# Altium schematic sheet 0099_STORAGE - M.SchDoc
size 848 x 558 mm
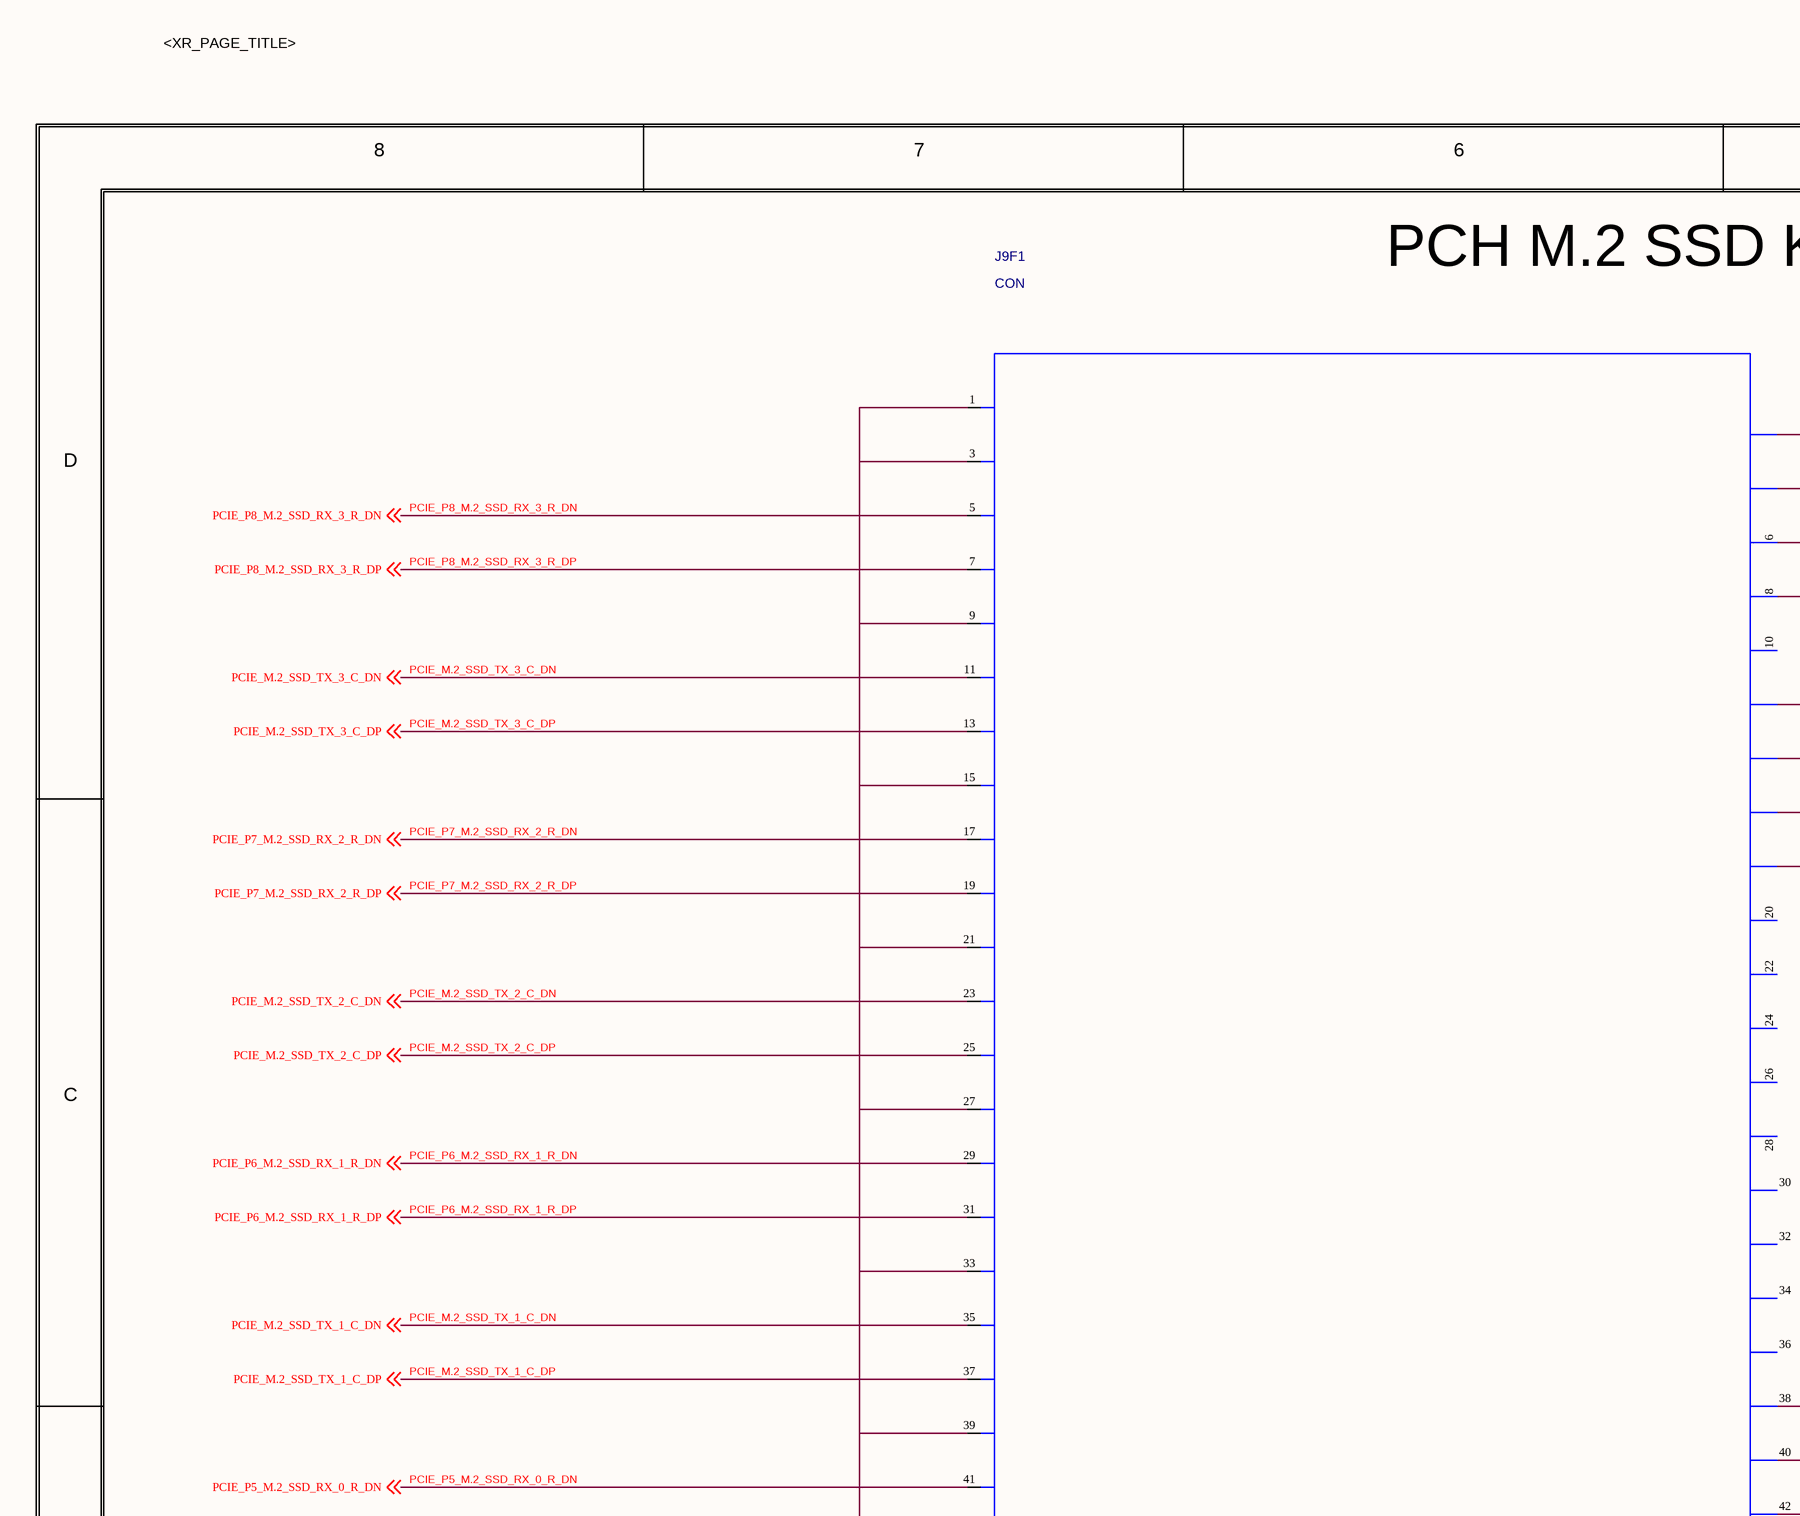
[diagram p0: 0099_STORAGE - M.SchDoc, top left]
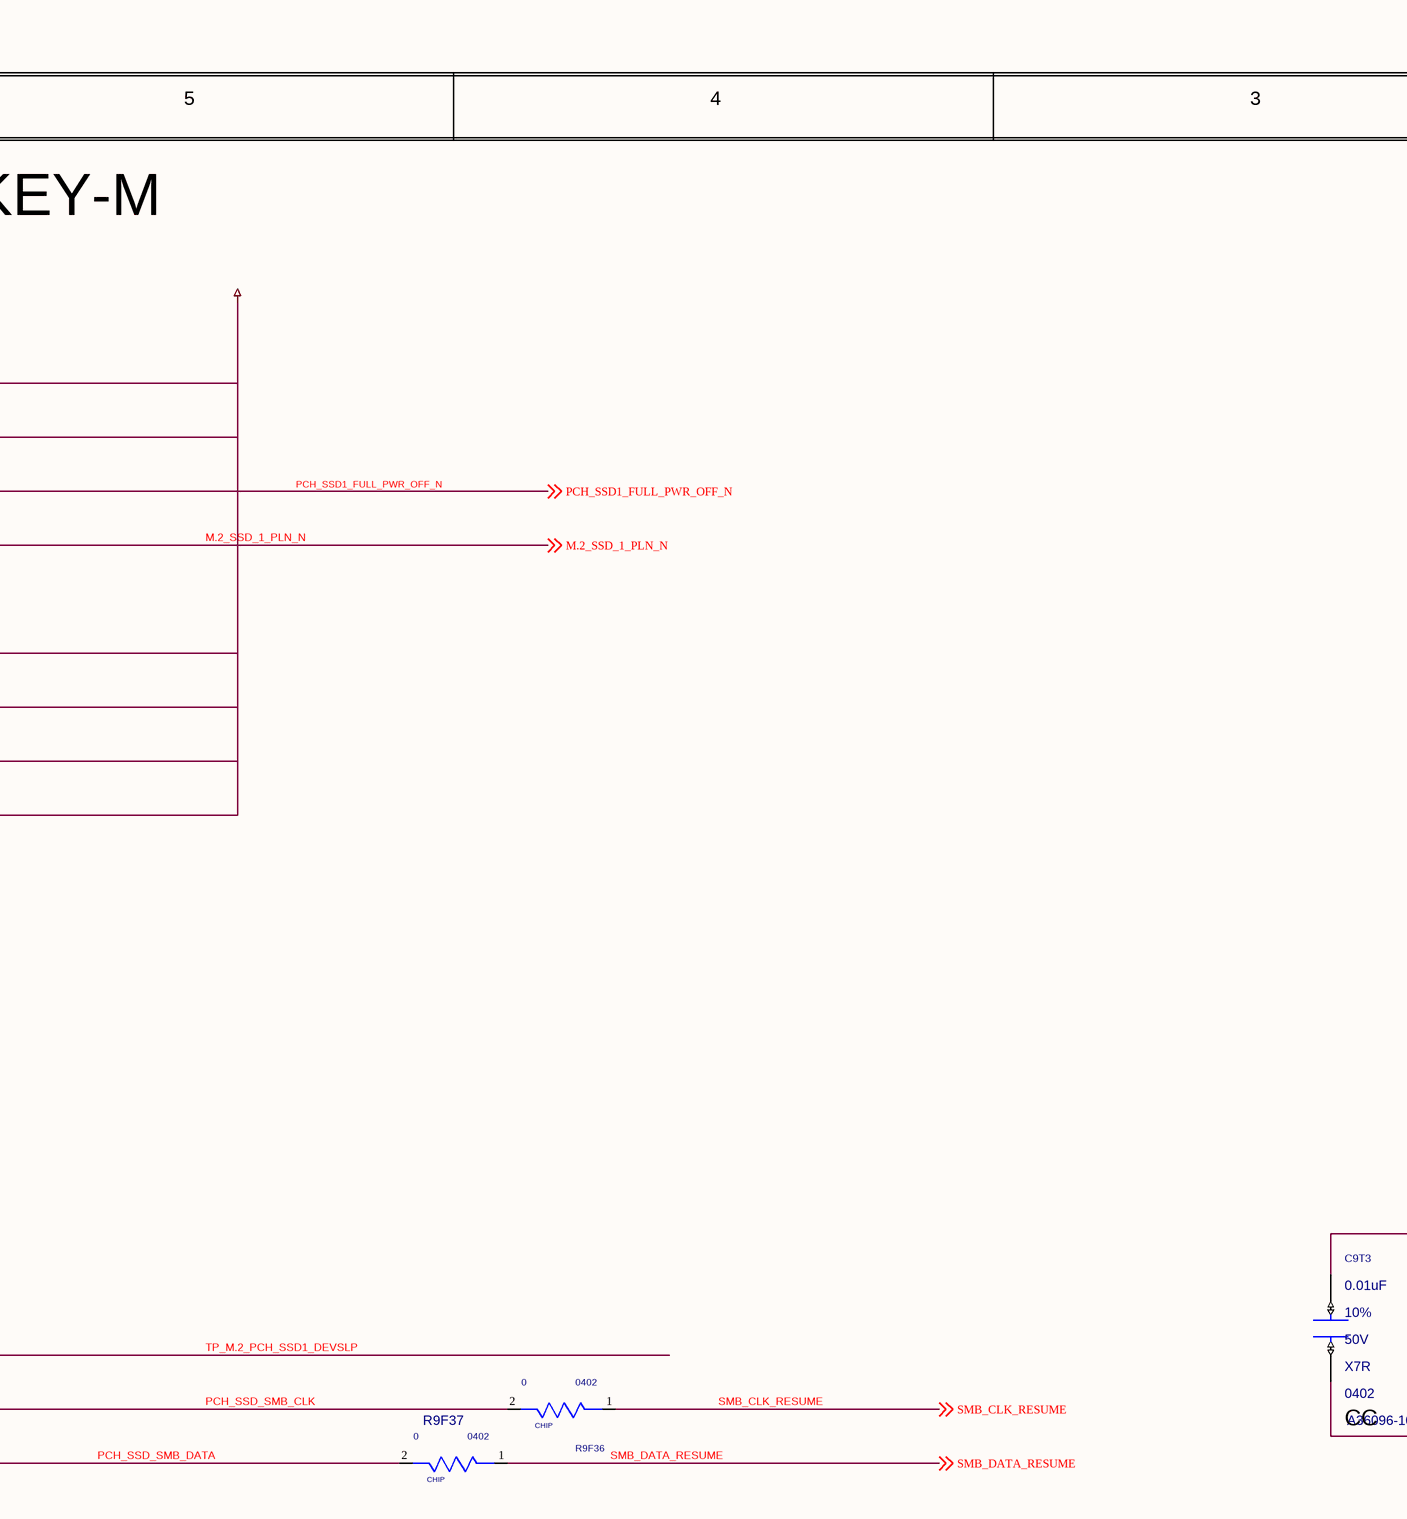
[diagram p1: 0099_STORAGE - M.SchDoc, top middle]
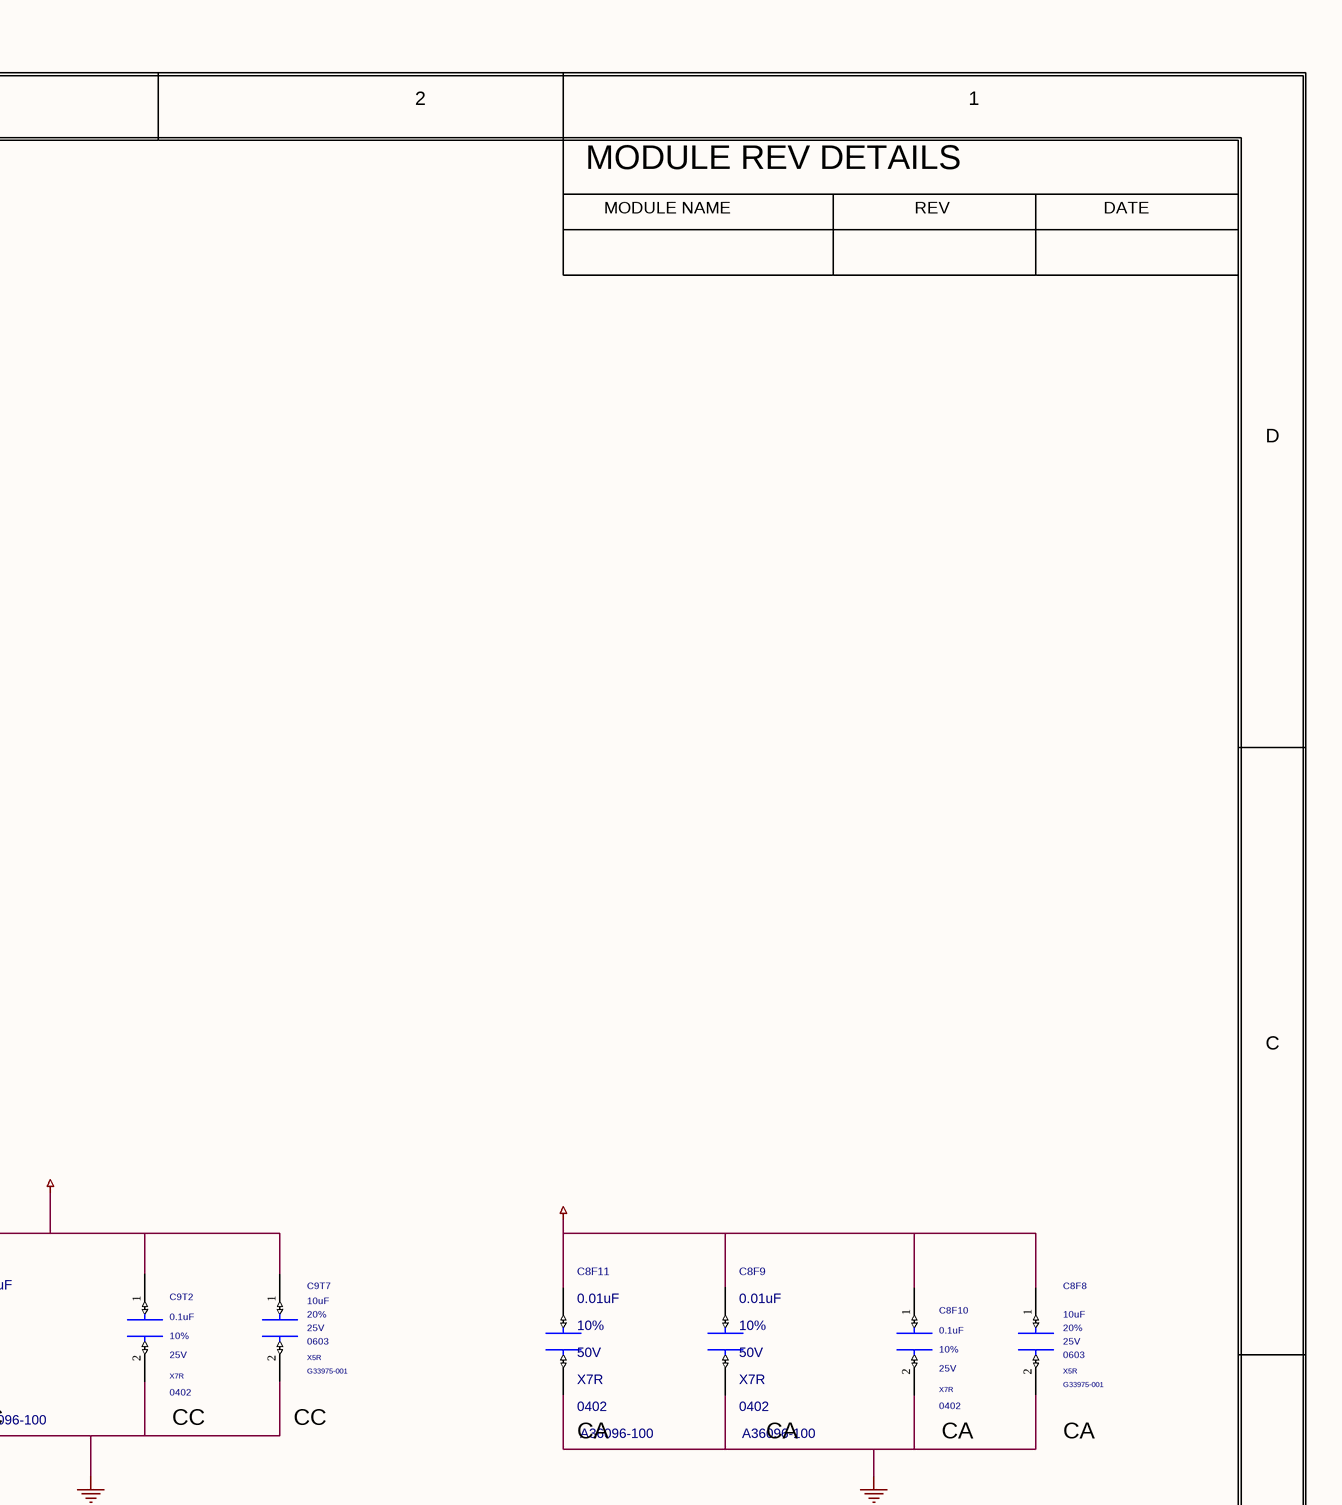
[diagram p2: 0099_STORAGE - M.SchDoc, top right]
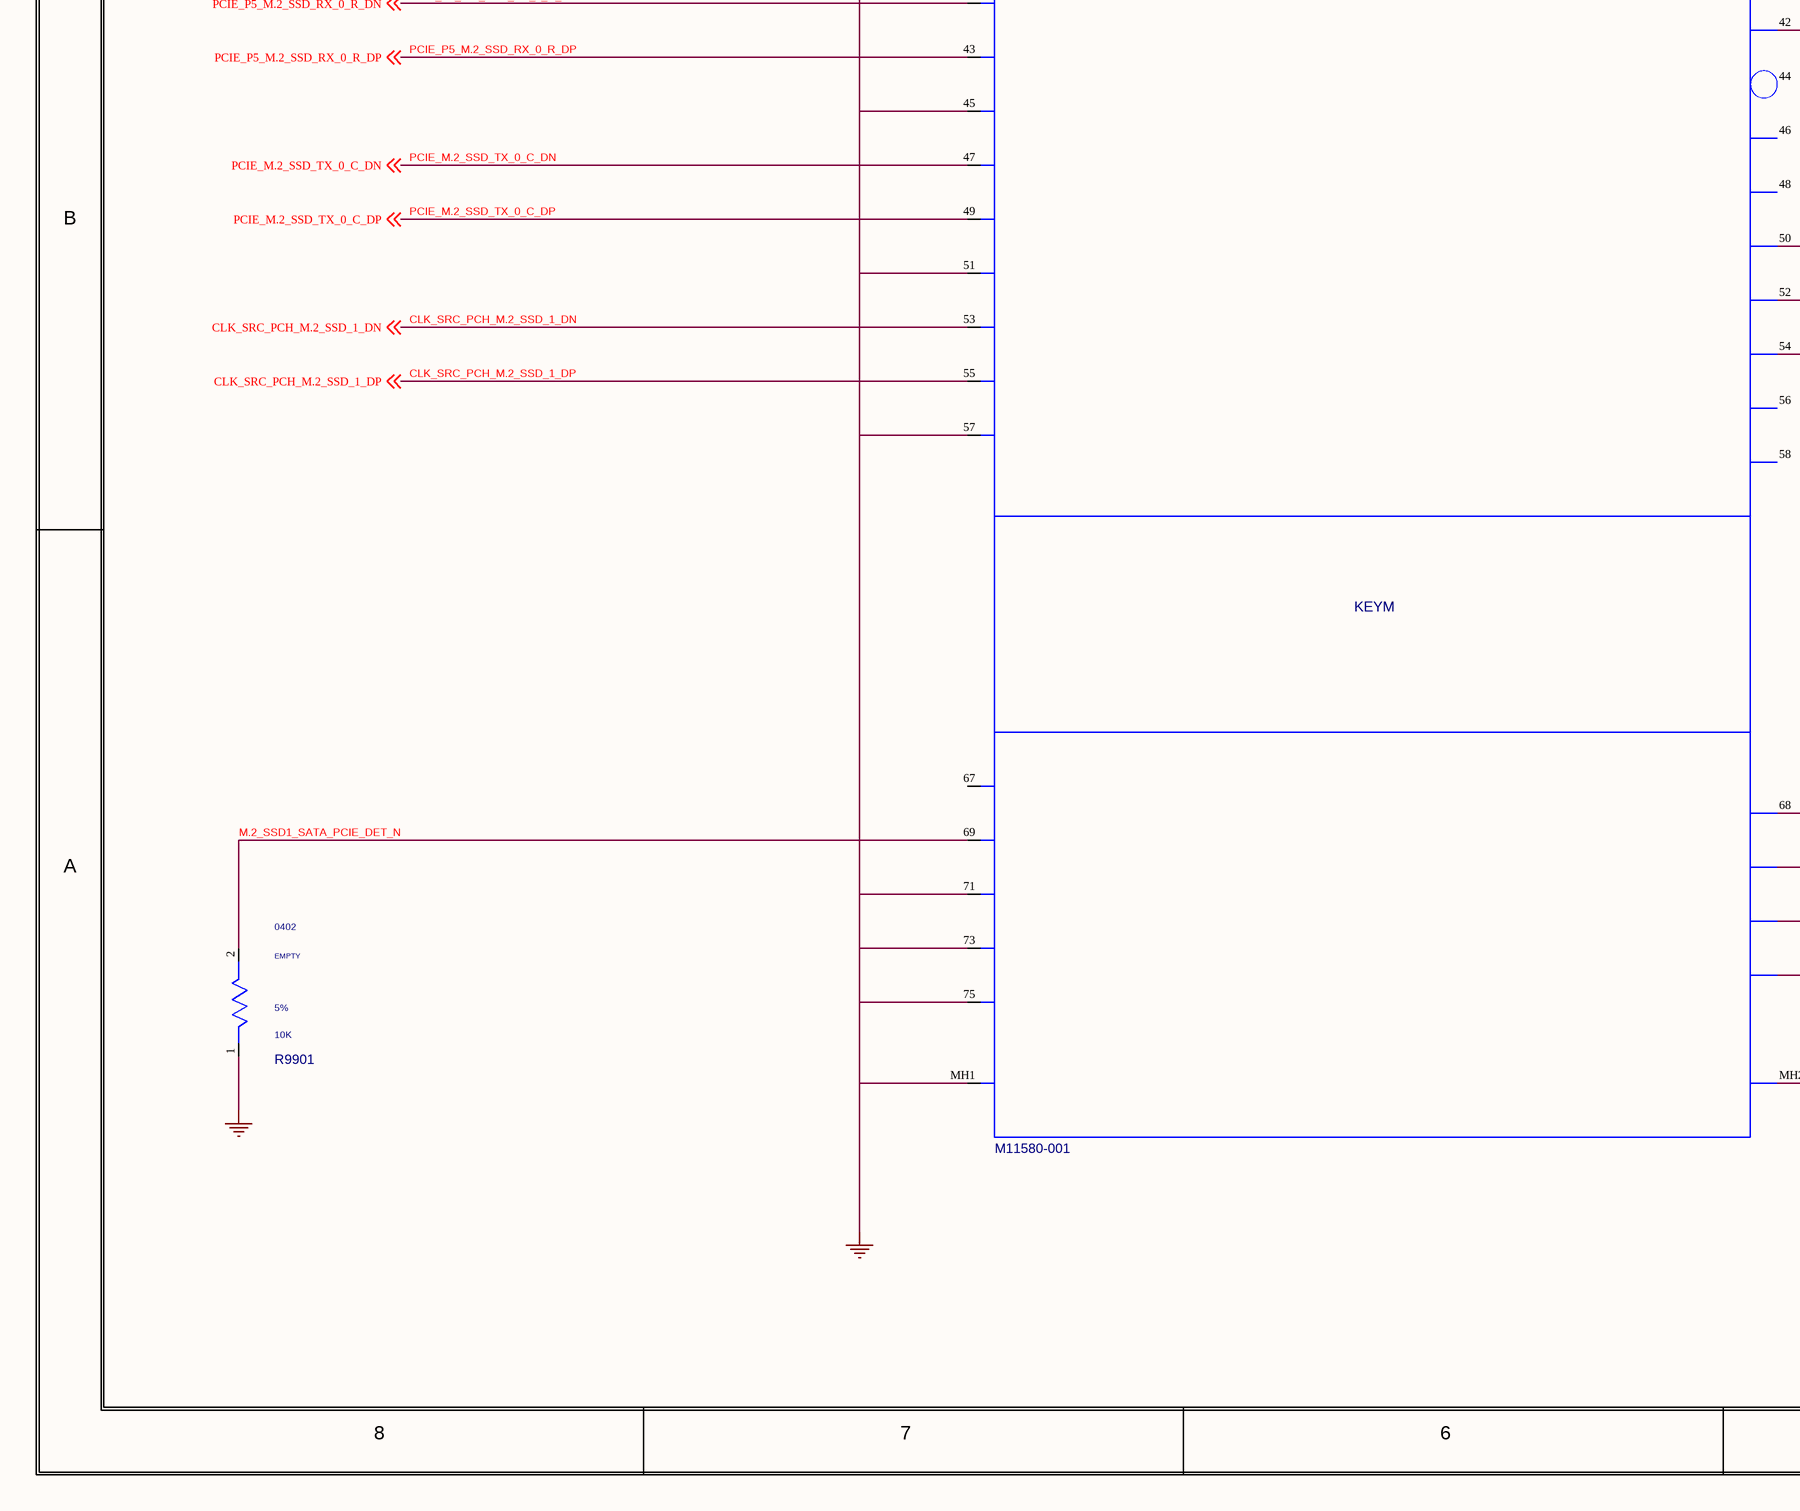
[diagram p3: 0099_STORAGE - M.SchDoc, bottom left]
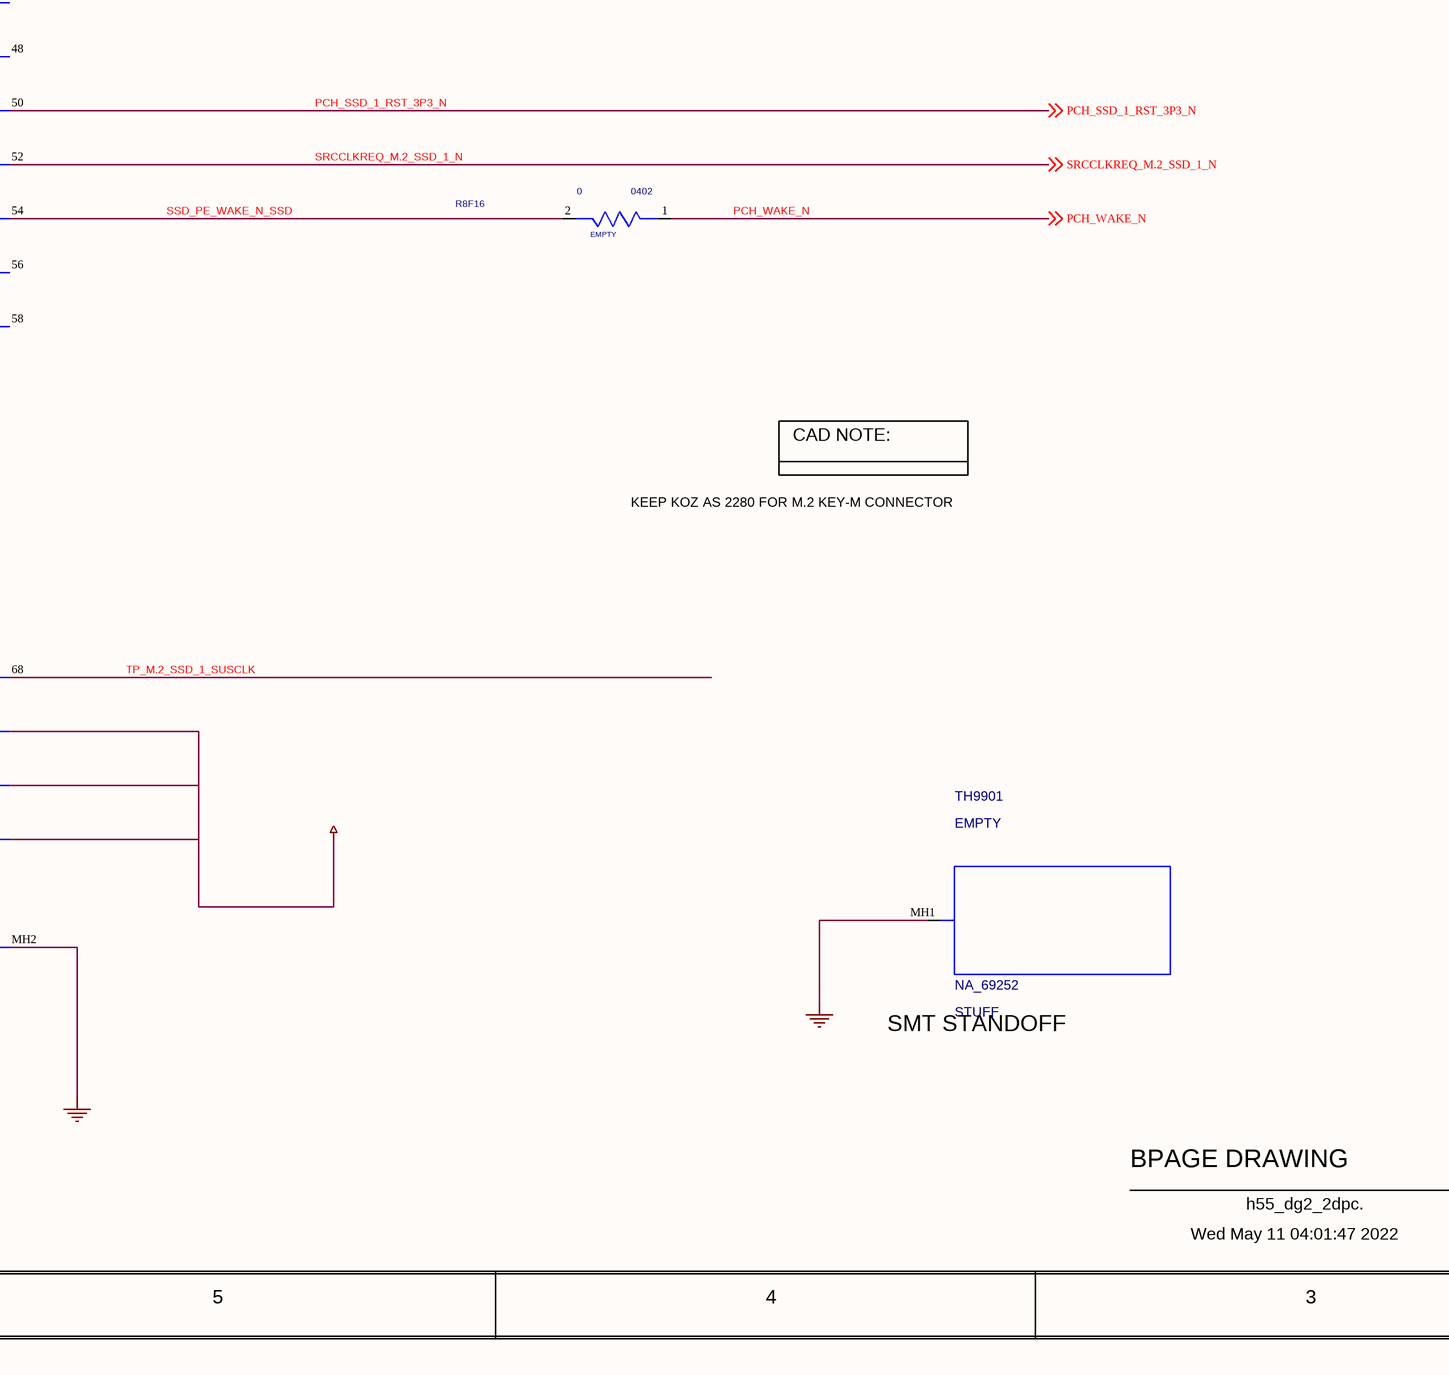
[diagram p4: 0099_STORAGE - M.SchDoc, bottom middle]
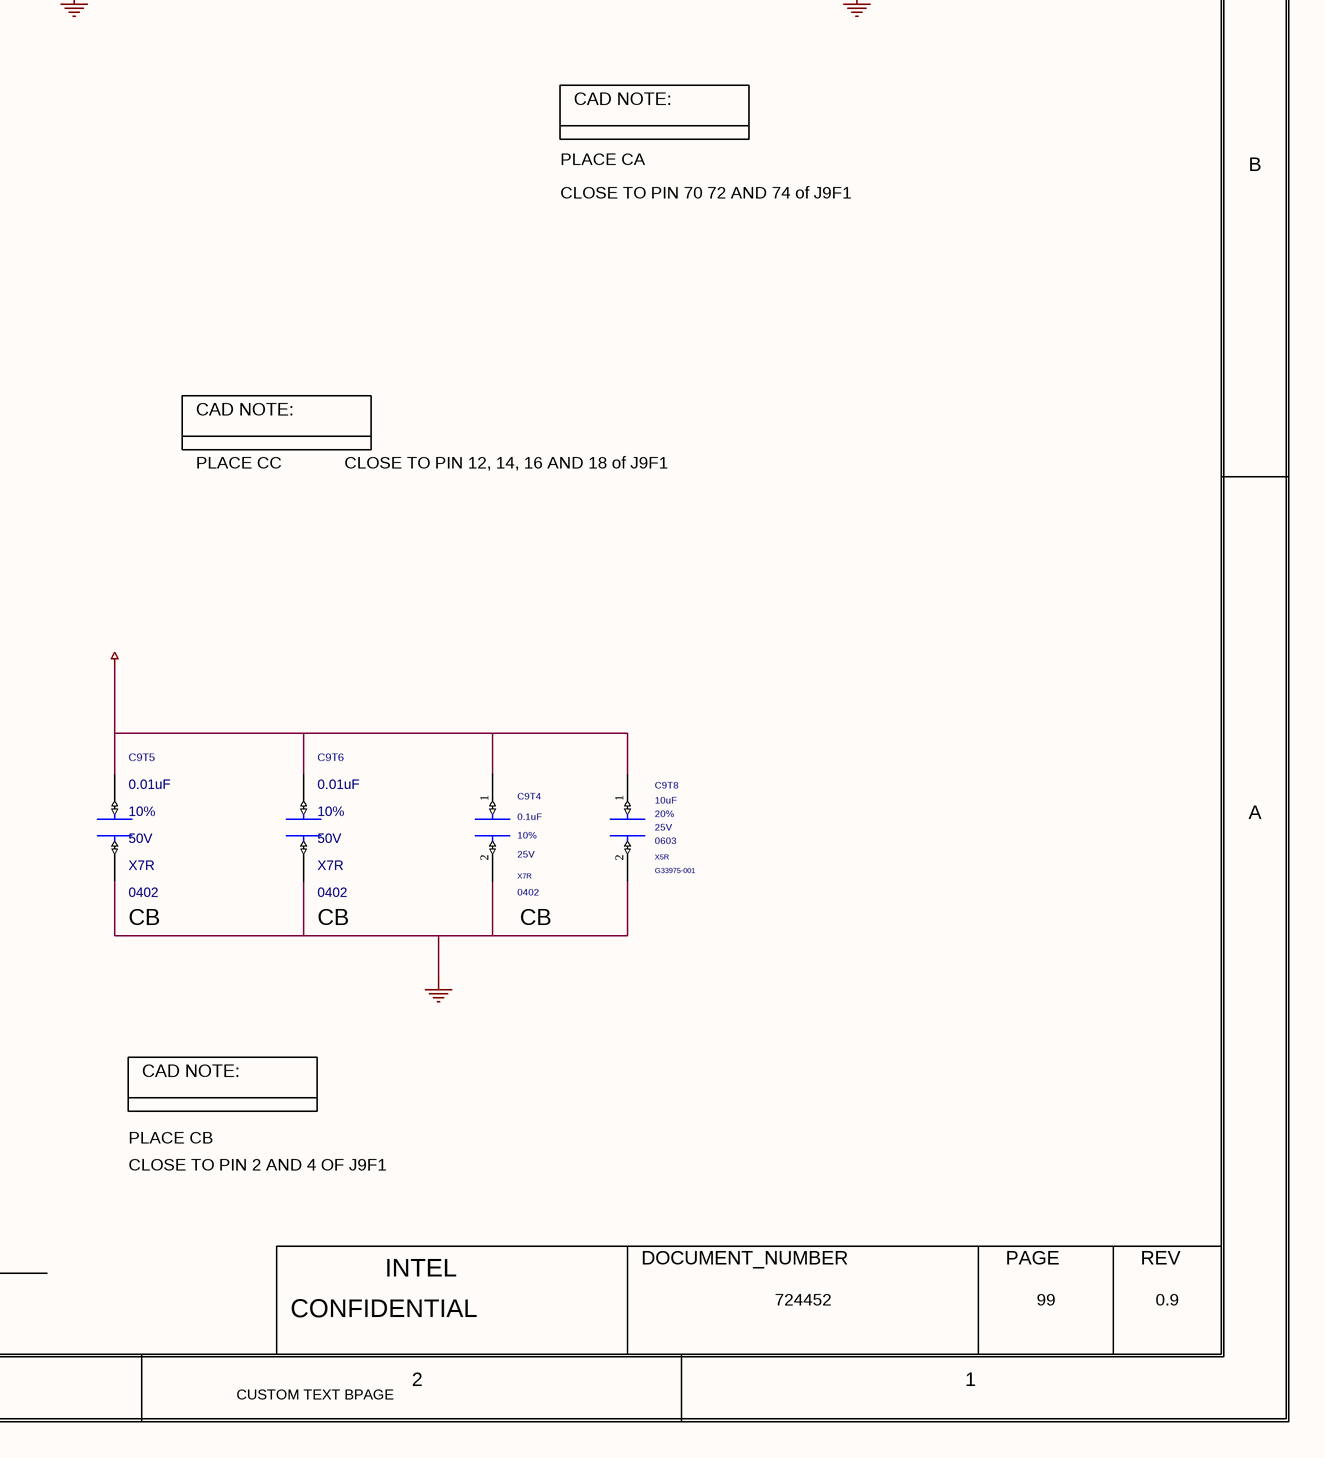
[diagram p5: 0099_STORAGE - M.SchDoc, bottom right]

## Parts
C8F8  10uF  MATERIAL: X5R  PACK_TYPE: 0603  PART_NUMBER: G33975-001  TOLERANCE: 20%  VOLTAGE: 25V  [SMC0603IA]
C8F9  0.01uF  MATERIAL: X7R  PACK_TYPE: 0402  PART_NUMBER: A36096-100  TOLERANCE: 10%  VOLTAGE: 50V  [CTK2_SM0402_1050X550_MA]
C8F10  0.1uF  MATERIAL: X7R  PACK_TYPE: 0402  TOLERANCE: 10%  VOLTAGE: 25V  [SMC0402IA]
C8F11  0.01uF  MATERIAL: X7R  PACK_TYPE: 0402  PART_NUMBER: A36096-100  TOLERANCE: 10%  VOLTAGE: 50V  [CTK2_SM0402_1050X550_MA]
C9T2  0.1uF  MATERIAL: X7R  PACK_TYPE: 0402  TOLERANCE: 10%  VOLTAGE: 25V  [SMC0402IA]
C9T3  0.01uF  MATERIAL: X7R  PACK_TYPE: 0402  PART_NUMBER: A36096-100  TOLERANCE: 10%  VOLTAGE: 50V  [CTK2_SM0402_1050X550_MA]
C9T4  0.1uF  MATERIAL: X7R  PACK_TYPE: 0402  TOLERANCE: 10%  VOLTAGE: 25V  [SMC0402IA]
C9T5  0.01uF  MATERIAL: X7R  PACK_TYPE: 0402  TOLERANCE: 10%  VOLTAGE: 50V  [CTK2_SM0402_1050X550_MA]
C9T6  0.01uF  MATERIAL: X7R  PACK_TYPE: 0402  TOLERANCE: 10%  VOLTAGE: 50V  [CTK2_SM0402_1050X550_MA]
C9T7  10uF  MATERIAL: X5R  PACK_TYPE: 0603  PART_NUMBER: G33975-001  TOLERANCE: 20%  VOLTAGE: 25V  [SMC0603IA]
C9T8  10uF  MATERIAL: X5R  PACK_TYPE: 0603  PART_NUMBER: G33975-001  TOLERANCE: 20%  VOLTAGE: 25V  [SMC0603IA]
J9F1  MATERIAL: CON  PART_NUMBER: M11580-001  [CTK0_M2_SJR_75P_KEYM_2EM_2M_500_MB_VR]  (hidden comment: C_M2_75P_KEYM_2EM)
R8F16  0  MATERIAL: EMPTY  PACK_TYPE: 0402  [SMR0402IA]
R9F36  0  MATERIAL: CHIP  PACK_TYPE: 0402  [SMR0402IA]
R9F37  0  MATERIAL: CHIP  PACK_TYPE: 0402  [SMR0402IA]
R9901  10K  MATERIAL: EMPTY  PACK_TYPE: 0402  TOLERANCE: 5%  [SMR0402IA]
TH9901  BOM_USE: STUFF  MATERIAL: EMPTY  PART_NUMBER: NA_69252  [MTG_5000P3500_MA]  (hidden comment: MTG_HOLE_2)

## Nets
3P3V_2: J9F1.2(3P3V_2)
3P3V_4: J9F1.4(3P3V_4)
3P3V_12: J9F1.12(3P3V_12)
3P3V_14: J9F1.14(3P3V_14)
3P3V_16: J9F1.16(3P3V_16)
3P3V_18: J9F1.18(3P3V_18)
3P3V_70: J9F1.70(3P3V_70)
3P3V_72: J9F1.72(3P3V_72)
3P3V_74: J9F1.74(3P3V_74)
+V3P3DX_PCH_SSD: C8F8.1(A) C8F9.1(A) C8F10.1(A) C8F11.1(A) C9T2.1(A) C9T3.1(A) C9T4.1(A) C9T5.1(A) C9T6.1(A) C9T7.1(A) C9T8.1(A)
GND: C8F8.2(B) C8F9.2(B) C8F10.2(B) C8F11.2(B) C9T2.2(B) C9T3.2(B) C9T4.2(B) C9T5.2(B) C9T6.2(B) C9T7.2(B) C9T8.2(B) J9F1.1(GND_1) J9F1.3(GND_3) J9F1.9(GND_9) J9F1.15(GND_15) J9F1.21(GND_21) J9F1.27(GND_27) J9F1.33(GND_33) J9F1.39(GND_39) J9F1.45(GND_45) J9F1.51(GND_51) J9F1.57(GND_57) J9F1.71(GND_71) J9F1.73(GND_73) J9F1.75(GND_75) J9F1.MH1 J9F1.MH2 R9901.1(A) TH9901.MH1
CLK_SRC_PCH_M.2_SSD_1_DN: J9F1.53(REFCLKN) ; off-sheet CLK_SRC_PCH_M.2_SSD_1_DN
CLK_SRC_PCH_M.2_SSD_1_DP: J9F1.55(REFCLKP) ; off-sheet CLK_SRC_PCH_M.2_SSD_1_DP
M.2_SSD1_SATA_PCIE_DET_N: J9F1.69(PEDET_NC_PCIE_GND_SATA) R9901.2(B)
M.2_SSD_1_PLN_N: J9F1.8(NC_8) ; off-sheet M.2_SSD_1_PLN_N
PCH_SSD1_FULL_PWR_OFF_N: J9F1.6(NC_6) ; off-sheet PCH_SSD1_FULL_PWR_OFF_N
PCH_SSD_1_RST_3P3_N: J9F1.50(PERST_N_NC) ; off-sheet PCH_SSD_1_RST_3P3_N
PCH_SSD_SMB_CLK: J9F1.40(SMB_CLK) R9F36.2(B)
PCH_SSD_SMB_DATA: J9F1.42(SMB_DATA) R9F37.2(B)
PCH_WAKE_N: R8F16.1(A) ; off-sheet PCH_WAKE_N
PCIE_M.2_SSD_TX_0_C_DN: J9F1.47(PETN0_SATA_AN) ; off-sheet PCIE_M.2_SSD_TX_0_C_DN
PCIE_M.2_SSD_TX_0_C_DP: J9F1.49(PETP0_SATA_AP) ; off-sheet PCIE_M.2_SSD_TX_0_C_DP
PCIE_M.2_SSD_TX_1_C_DN: J9F1.35(PETN1) ; off-sheet PCIE_M.2_SSD_TX_1_C_DN
PCIE_M.2_SSD_TX_1_C_DP: J9F1.37(PETP1) ; off-sheet PCIE_M.2_SSD_TX_1_C_DP
PCIE_M.2_SSD_TX_2_C_DN: J9F1.23(PETN2) ; off-sheet PCIE_M.2_SSD_TX_2_C_DN
PCIE_M.2_SSD_TX_2_C_DP: J9F1.25(PETP2) ; off-sheet PCIE_M.2_SSD_TX_2_C_DP
PCIE_M.2_SSD_TX_3_C_DN: J9F1.11(PETN3) ; off-sheet PCIE_M.2_SSD_TX_3_C_DN
PCIE_M.2_SSD_TX_3_C_DP: J9F1.13(PETP3) ; off-sheet PCIE_M.2_SSD_TX_3_C_DP
PCIE_P5_M.2_SSD_RX_0_R_DN: J9F1.41(PERN0_SATA_BP) ; off-sheet PCIE_P5_M.2_SSD_RX_0_R_DN
PCIE_P5_M.2_SSD_RX_0_R_DP: J9F1.43(PERP0_SATA_BN) ; off-sheet PCIE_P5_M.2_SSD_RX_0_R_DP
PCIE_P6_M.2_SSD_RX_1_R_DN: J9F1.29(PERN1) ; off-sheet PCIE_P6_M.2_SSD_RX_1_R_DN
PCIE_P6_M.2_SSD_RX_1_R_DP: J9F1.31(PERP1) ; off-sheet PCIE_P6_M.2_SSD_RX_1_R_DP
PCIE_P7_M.2_SSD_RX_2_R_DN: J9F1.17(PERN2) ; off-sheet PCIE_P7_M.2_SSD_RX_2_R_DN
PCIE_P7_M.2_SSD_RX_2_R_DP: J9F1.19(PERP2) ; off-sheet PCIE_P7_M.2_SSD_RX_2_R_DP
PCIE_P8_M.2_SSD_RX_3_R_DN: J9F1.5(PERN3) ; off-sheet PCIE_P8_M.2_SSD_RX_3_R_DN
PCIE_P8_M.2_SSD_RX_3_R_DP: J9F1.7(PERP3) ; off-sheet PCIE_P8_M.2_SSD_RX_3_R_DP
SMB_CLK_RESUME: R9F36.1(A) ; off-sheet SMB_CLK_RESUME
SMB_DATA_RESUME: R9F37.1(A) ; off-sheet SMB_DATA_RESUME
SRCCLKREQ_M.2_SSD_1_N: J9F1.52(CLKREQ_N_NC) ; off-sheet SRCCLKREQ_M.2_SSD_1_N
SSD_PE_WAKE_N_SSD: J9F1.54(PEWAKE_N_NC) R8F16.2(B)
TP_M.2_PCH_SSD1_DEVSLP: J9F1.38(DEVSLP)
TP_M.2_SSD_1_SUSCLK: J9F1.68(SUSCLK)

Not connected (* = marked no-connect by the designer): J9F1 10(DAS_DSS_LED_1_N) 20(NC_20) 22(NC_22) 24(NC_24) 26(NC_26) 28(NC_28) 30(NC_30) 32(NC_32) 34(NC_34) 36(NC_36) 44(ALERT_N) 46(NC_46) 48(NC_48) 56(NC_56) 58(NC_58) 67(NC_67)

## Notes on the sheet
- <XR_PAGE_TITLE>
- 8
- 7
- 6
- 5
- 4
- 3
- 2
- 1
- MODULE REV DETAILS
- PCH M.2 SSD KEY-M
- MODULE NAME
- REV
- DATE
- D
- C
- CC
- CA
- CAD NOTE:
- B
- CLOSE TO PIN 70 72 AND 74 of J9F1
- PLACE CA
- PLACE CC
- CLOSE TO PIN 12, 14, 16 AND 18 of J9F1
- KEEP KOZ AS 2280 FOR M.2 KEY-M CONNECTOR
- A
- CB
- SMT STANDOFF
- PLACE CB
- CLOSE TO PIN 2 AND 4 OF J9F1
- BPAGE DRAWING
- INTEL
- DOCUMENT_NUMBER
- PAGE
- Wed May 11 04:01:47 2022
- h55_dg2_2dpc.
- CONFIDENTIAL
- 724452
- 99
- 0.9
- CUSTOM TEXT BPAGE
- (in symbol C_M2_75P_KEYM_2EM) KEYM

## Library data of the parts
C8F8 = CAP: CDS_PHYS_PART_NAME: CAP_0603-G33975-001,X5R,10UF,25V,20%,LPDB,GENERIC; OriginalSymbolOrigin: (-50,25); XY: (-375,2775); VER: 1; ROT: 0; PHYS_PAGE: 99; LOCATION: C8F8; IP: GENERIC; FP_TECH: LPDB; DRAWING: @RVP1_ADL_SB_ADP_S_DDR5_SODIMM_2DPC_LIB.H55_DG2_2DPC(SCH_1):PAGE470; CDS_LIB: discrete; PCB Footprint: SMC0603IA; SEC_TYPE: 0603; CHIPS_PART_NAME: CAP; CDS_PART_NAME: CAP_0603-G33975-001,X5R,10UF,25V,20%,LPDB,GENERIC; CDS_LOCATION: C8F8; ASI_MODEL: G33975-001
C8F9 = C_CAP: CDS_PHYS_PART_NAME: C_CAP_0402-A36096-100,X7R,0.01UF,50V,10%,TK2,GENERIC; CDS_LMAN_SYM_OUTLINE: -50,50,50,-50; FP_TECH: TK2; IP: GENERIC; ROOM: NONE; OriginalSymbolOrigin: (-50,25); XY: (-950,2775); VER: 1; ROT: 0; PHYS_PAGE: 99; LOCATION: C8F9; DRAWING: @RVP1_ADL_SB_ADP_S_DDR5_SODIMM_2DPC_LIB.H55_DG2_2DPC(SCH_1):PAGE470; CDS_LIB: c_discrete; VARIANT: ?; PCB Footprint: CTK2_SM0402_1050X550_MA; CHIPS_PART_NAME: C_CAP; CDS_PART_NAME: C_CAP_0402-A36096-100,X7R,0.01UF,50V,10%,TK2,GENERIC; CDS_LOCATION: C8F9
C8F10 = CAP: PART_NUMBER: A36096-112; CDS_PHYS_PART_NAME: CAP_0402-A36096-112,X7R,0.1UF,25V,10%,LPDB,GENERIC; OriginalSymbolOrigin: (-50,25); XY: (-600,2775); VER: 1; ROT: 0; PHYS_PAGE: 99; LOCATION: C8F10; IP: GENERIC; FP_TECH: LPDB; DRAWING: @RVP1_ADL_SB_ADP_S_DDR5_SODIMM_2DPC_LIB.H55_DG2_2DPC(SCH_1):PAGE470; CDS_LIB: discrete; PCB Footprint: SMC0402IA; CHIPS_PART_NAME: CAP; CDS_PART_NAME: CAP_0402-A36096-112,X7R,0.1UF,25V,10%,LPDB,GENERIC; CDS_LOCATION: C8F10; ASI_MODEL: A36096-112
C8F11 = C_CAP: CDS_PHYS_PART_NAME: C_CAP_0402-A36096-100,X7R,0.01UF,50V,10%,TK2,GENERIC; CDS_LMAN_SYM_OUTLINE: -50,50,50,-50; FP_TECH: TK2; IP: GENERIC; ROOM: NONE; OriginalSymbolOrigin: (-50,25); XY: (-1250,2775); VER: 1; ROT: 0; PHYS_PAGE: 99; LOCATION: C8F11; DRAWING: @RVP1_ADL_SB_ADP_S_DDR5_SODIMM_2DPC_LIB.H55_DG2_2DPC(SCH_1):PAGE470; CDS_LIB: c_discrete; VARIANT: ?; PCB Footprint: CTK2_SM0402_1050X550_MA; CHIPS_PART_NAME: C_CAP; CDS_PART_NAME: C_CAP_0402-A36096-100,X7R,0.01UF,50V,10%,TK2,GENERIC; CDS_LOCATION: C8F11
C9T2 = CAP: PART_NUMBER: A36096-112; CDS_PHYS_PART_NAME: CAP_0402-A36096-112,X7R,0.1UF,25V,10%,LPDB,GENERIC; OriginalSymbolOrigin: (-50,25); XY: (-2025,2800); VER: 1; ROT: 0; PHYS_PAGE: 99; LOCATION: C9T2; IP: GENERIC; FP_TECH: LPDB; DRAWING: @RVP1_ADL_SB_ADP_S_DDR5_SODIMM_2DPC_LIB.H55_DG2_2DPC(SCH_1):PAGE470; CDS_LIB: discrete; PCB Footprint: SMC0402IA; SEC_TYPE: 0402; CHIPS_PART_NAME: CAP; CDS_PART_NAME: CAP_0402-A36096-112,X7R,0.1UF,25V,10%,LPDB,GENERIC; CDS_LOCATION: C9T2; ASI_MODEL: A36096-112
C9T3 = C_CAP: CDS_PHYS_PART_NAME: C_CAP_0402-A36096-100,X7R,0.01UF,50V,10%,TK2,GENERIC; CDS_LMAN_SYM_OUTLINE: -50,50,50,-50; FP_TECH: TK2; IP: GENERIC; ROOM: NONE; OriginalSymbolOrigin: (-50,25); XY: (-2375,2800); VER: 1; ROT: 0; PHYS_PAGE: 99; LOCATION: C9T3; DRAWING: @RVP1_ADL_SB_ADP_S_DDR5_SODIMM_2DPC_LIB.H55_DG2_2DPC(SCH_1):PAGE470; CDS_LIB: c_discrete; VARIANT: ?; PCB Footprint: CTK2_SM0402_1050X550_MA; CHIPS_PART_NAME: C_CAP; CDS_PART_NAME: C_CAP_0402-A36096-100,X7R,0.01UF,50V,10%,TK2,GENERIC; CDS_LOCATION: C9T3
C9T4 = CAP: PART_NUMBER: A36096-112; CDS_PHYS_PART_NAME: CAP_0402-A36096-112,X7R,0.1UF,25V,10%,LPDB,GENERIC; OriginalSymbolOrigin: (-50,25); XY: (-1350,975); VER: 1; ROT: 0; PHYS_PAGE: 99; LOCATION: C9T4; IP: GENERIC; FP_TECH: LPDB; DRAWING: @RVP1_ADL_SB_ADP_S_DDR5_SODIMM_2DPC_LIB.H55_DG2_2DPC(SCH_1):PAGE470; CDS_LIB: discrete; PCB Footprint: SMC0402IA; CHIPS_PART_NAME: CAP; CDS_PART_NAME: CAP_0402-A36096-112,X7R,0.1UF,25V,10%,LPDB,GENERIC; CDS_LOCATION: C9T4; ASI_MODEL: A36096-112
C9T5 = C_CAP: PART_NUMBER: A36096-100; CDS_PHYS_PART_NAME: C_CAP_0402-A36096-100,X7R,0.01UF,50V,10%,TK2,GENERIC; CDS_LMAN_SYM_OUTLINE: -50,50,50,-50; FP_TECH: TK2; IP: GENERIC; ROOM: NONE; OriginalSymbolOrigin: (-50,25); XY: (-2050,975); VER: 1; ROT: 0; PHYS_PAGE: 99; LOCATION: C9T5; DRAWING: @RVP1_ADL_SB_ADP_S_DDR5_SODIMM_2DPC_LIB.H55_DG2_2DPC(SCH_1):PAGE470; CDS_LIB: c_discrete; VARIANT: ?; PCB Footprint: CTK2_SM0402_1050X550_MA; CHIPS_PART_NAME: C_CAP; CDS_PART_NAME: C_CAP_0402-A36096-100,X7R,0.01UF,50V,10%,TK2,GENERIC; CDS_LOCATION: C9T5
C9T6 = C_CAP: PART_NUMBER: A36096-100; CDS_PHYS_PART_NAME: C_CAP_0402-A36096-100,X7R,0.01UF,50V,10%,TK2,GENERIC; CDS_LMAN_SYM_OUTLINE: -50,50,50,-50; FP_TECH: TK2; IP: GENERIC; ROOM: NONE; OriginalSymbolOrigin: (-50,25); XY: (-1700,975); VER: 1; ROT: 0; PHYS_PAGE: 99; LOCATION: C9T6; DRAWING: @RVP1_ADL_SB_ADP_S_DDR5_SODIMM_2DPC_LIB.H55_DG2_2DPC(SCH_1):PAGE470; CDS_LIB: c_discrete; VARIANT: ?; PCB Footprint: CTK2_SM0402_1050X550_MA; CHIPS_PART_NAME: C_CAP; CDS_PART_NAME: C_CAP_0402-A36096-100,X7R,0.01UF,50V,10%,TK2,GENERIC; CDS_LOCATION: C9T6
C9T7 = CAP: CDS_PHYS_PART_NAME: CAP_0603-G33975-001,X5R,10UF,25V,20%,LPDB,GENERIC; OriginalSymbolOrigin: (-50,25); XY: (-1775,2800); VER: 1; ROT: 0; PHYS_PAGE: 99; LOCATION: C9T7; IP: GENERIC; FP_TECH: LPDB; DRAWING: @RVP1_ADL_SB_ADP_S_DDR5_SODIMM_2DPC_LIB.H55_DG2_2DPC(SCH_1):PAGE470; CDS_LIB: discrete; PCB Footprint: SMC0603IA; SEC_TYPE: 0603; CHIPS_PART_NAME: CAP; CDS_PART_NAME: CAP_0603-G33975-001,X5R,10UF,25V,20%,LPDB,GENERIC; CDS_LOCATION: C9T7; ASI_MODEL: G33975-001
C9T8 = CAP: CDS_PHYS_PART_NAME: CAP_0603-G33975-001,X5R,10UF,25V,20%,LPDB,GENERIC; OriginalSymbolOrigin: (-50,25); XY: (-1100,975); VER: 1; ROT: 0; PHYS_PAGE: 99; LOCATION: C9T8; IP: GENERIC; FP_TECH: LPDB; DRAWING: @RVP1_ADL_SB_ADP_S_DDR5_SODIMM_2DPC_LIB.H55_DG2_2DPC(SCH_1):PAGE470; CDS_LIB: discrete; PCB Footprint: SMC0603IA; SEC_TYPE: 0603; CHIPS_PART_NAME: CAP; CDS_PART_NAME: CAP_0603-G33975-001,X5R,10UF,25V,20%,LPDB,GENERIC; CDS_LOCATION: C9T8; ASI_MODEL: G33975-001
J9F1 = C_M2_75P_KEYM_2EM: CDS_PHYS_PART_NAME: C_M2_75P_KEYM_2EM_SM-M11580-001,CON,C_M2_75P_KEYM_2EM,TK0,GENERA; CDS_LMAN_SYM_OUTLINE: -700,2100,700,-2100; FP_TECH: TK0; IP: GENERIC; PACK_TYPE: SM; ROOM: NONE; OriginalSymbolOrigin: (-725,2100); XY: (-5650,2600); VER: 1; ROT: 0; PHYS_PAGE: 99; LOCATION: J9F1; DRAWING: @RVP1_ADL_SB_ADP_S_DDR5_SODIMM_2DPC_LIB.H55_DG2_2DPC(SCH_1):PAGE470; CDS_LIB: c_connector; VARIANT: ?; PCB Footprint: CTK0_M2_SJR_75P_KEYM_2EM_2M_500_MB_VR; SEC_TYPE: SM; CHIPS_PART_NAME: C_M2_75P_KEYM_2EM; CDS_PART_NAME: C_M2_75P_KEYM_2EM_SM-M11580-001,CON,C_M2_75P_KEYM_2EM,TK0,GENERA; CDS_LOCATION: J9F1
R8F16 = RES#1: PART_NUMBER: A93549-001; CHIPS_PART_NAME: RES; CDS_PHYS_PART_NAME: RES_0402-A93549-001,EMPTY,0,5%,1/16W,LPDB,GENERIC; TOLERANCE: 5%; WATTAGE: 1/16W; OriginalSymbolOrigin: (-75,25); XY: (-3775,1950); VER: 1; ROT: 2; PHYS_PAGE: 99; LOCATION: R8F16; IP: GENERIC; FP_TECH: LPDB; DRAWING: @RVP1_ADL_SB_ADP_S_DDR5_SODIMM_2DPC_LIB.H55_DG2_2DPC(SCH_1):PAGE470; CDS_LIB: discrete; PCB Footprint: SMR0402IA; SEC_TYPE: 0402; CDS_PART_NAME: RES_0402-A93549-001,EMPTY,0,5%,1/16W,LPDB,GENERIC; CDS_LOCATION: R8F16; ASI_MODEL: A93549-001
R9F36 = RES#1: PART_NUMBER: A93549-001; CHIPS_PART_NAME: RES; CDS_PHYS_PART_NAME: RES_0402-A93549-001,CHIP,0,5%,1/16W,LPDB,GENERIC; TOLERANCE: 5%; WATTAGE: 1/16W; OriginalSymbolOrigin: (-75,25); XY: (-3800,2650); VER: 1; ROT: 2; PHYS_PAGE: 99; LOCATION: R9F36; IP: GENERIC; FP_TECH: LPDB; DRAWING: @RVP1_ADL_SB_ADP_S_DDR5_SODIMM_2DPC_LIB.H55_DG2_2DPC(SCH_1):PAGE470; CDS_LIB: discrete; PCB Footprint: SMR0402IA; CDS_PART_NAME: RES_0402-A93549-001,CHIP,0,5%,1/16W,LPDB,GENERIC; CDS_LOCATION: R9F36; ASI_MODEL: A93549-001
R9F37 = RES#1: PART_NUMBER: A93549-001; CHIPS_PART_NAME: RES; CDS_PHYS_PART_NAME: RES_0402-A93549-001,CHIP,0,5%,1/16W,LPDB,GENERIC; TOLERANCE: 5%; WATTAGE: 1/16W; OriginalSymbolOrigin: (-75,25); XY: (-4000,2550); VER: 1; ROT: 2; PHYS_PAGE: 99; LOCATION: R9F37; IP: GENERIC; FP_TECH: LPDB; DRAWING: @RVP1_ADL_SB_ADP_S_DDR5_SODIMM_2DPC_LIB.H55_DG2_2DPC(SCH_1):PAGE470; CDS_LIB: discrete; PCB Footprint: SMR0402IA; CDS_PART_NAME: RES_0402-A93549-001,CHIP,0,5%,1/16W,LPDB,GENERIC; CDS_LOCATION: R9F37; ASI_MODEL: A93549-001
R9901 = RES: PART_NUMBER: G21497-014; CDS_PHYS_PART_NAME: RES_0402-G21497-014,EMPTY,10K,5%,1/16W,LPDB,GENERIC; WATTAGE: 1/16W; OriginalSymbolOrigin: (-25,75); XY: (-7750,750); VER: 2; ROT: 6; PHYS_PAGE: 99; LOCATION: R9901; IP: GENERIC; FP_TECH: LPDB; DRAWING: @RVP1_ADL_SB_ADP_S_DDR5_SODIMM_2DPC_LIB.H55_DG2_2DPC(SCH_1):PAGE470; CDS_LIB: discrete; PCB Footprint: SMR0402IA; CHIPS_PART_NAME: RES; CDS_PART_NAME: RES_0402-G21497-014,EMPTY,10K,5%,1/16W,LPDB,GENERIC; CDS_LOCATION: R9901; ASI_MODEL: G21497-014
TH9901 = MTG_HOLE_2: CDS_PHYS_PART_NAME: MTG_HOLE_2_TH-NA_69252,EMPTY,MTG_HOLE,TK0,GENERIC; CDS_LMAN_SYM_OUTLINE: -200,100,200,-100; FP_TECH: TK0; IP: GENERIC; PACK_TYPE: TH; ROOM: NONE; OriginalSymbolOrigin: (-225,100); XY: (-2950,650); VER: 1; ROT: 0; PHYS_PAGE: 99; LOCATION: TH9901; DRAWING: @RVP1_ADL_SB_ADP_S_DDR5_SODIMM_2DPC_LIB.H55_DG2_2DPC(SCH_1):PAGE470; CDS_LIB: local; VARIANT: ?; PCB Footprint: MTG_5000P3500_MA; CHIPS_PART_NAME: MTG_HOLE_2; CDS_PART_NAME: MTG_HOLE_2_TH-NA_69252,EMPTY,MTG_HOLE,TK0,GENERIC; CDS_LOCATION: TH9901